# Altium schematic sheet Encoder_Input.SchDoc: STM32F446 CNC
size B; Author: AM; CompanyName: Expatria Technologies; DrawnBy: A.Marles; Engineer: AM; Organization: Expatria Technolgoies; DocumentNumber: 11; Revision: A1; SheetNumber: 11; SheetTotal: 14
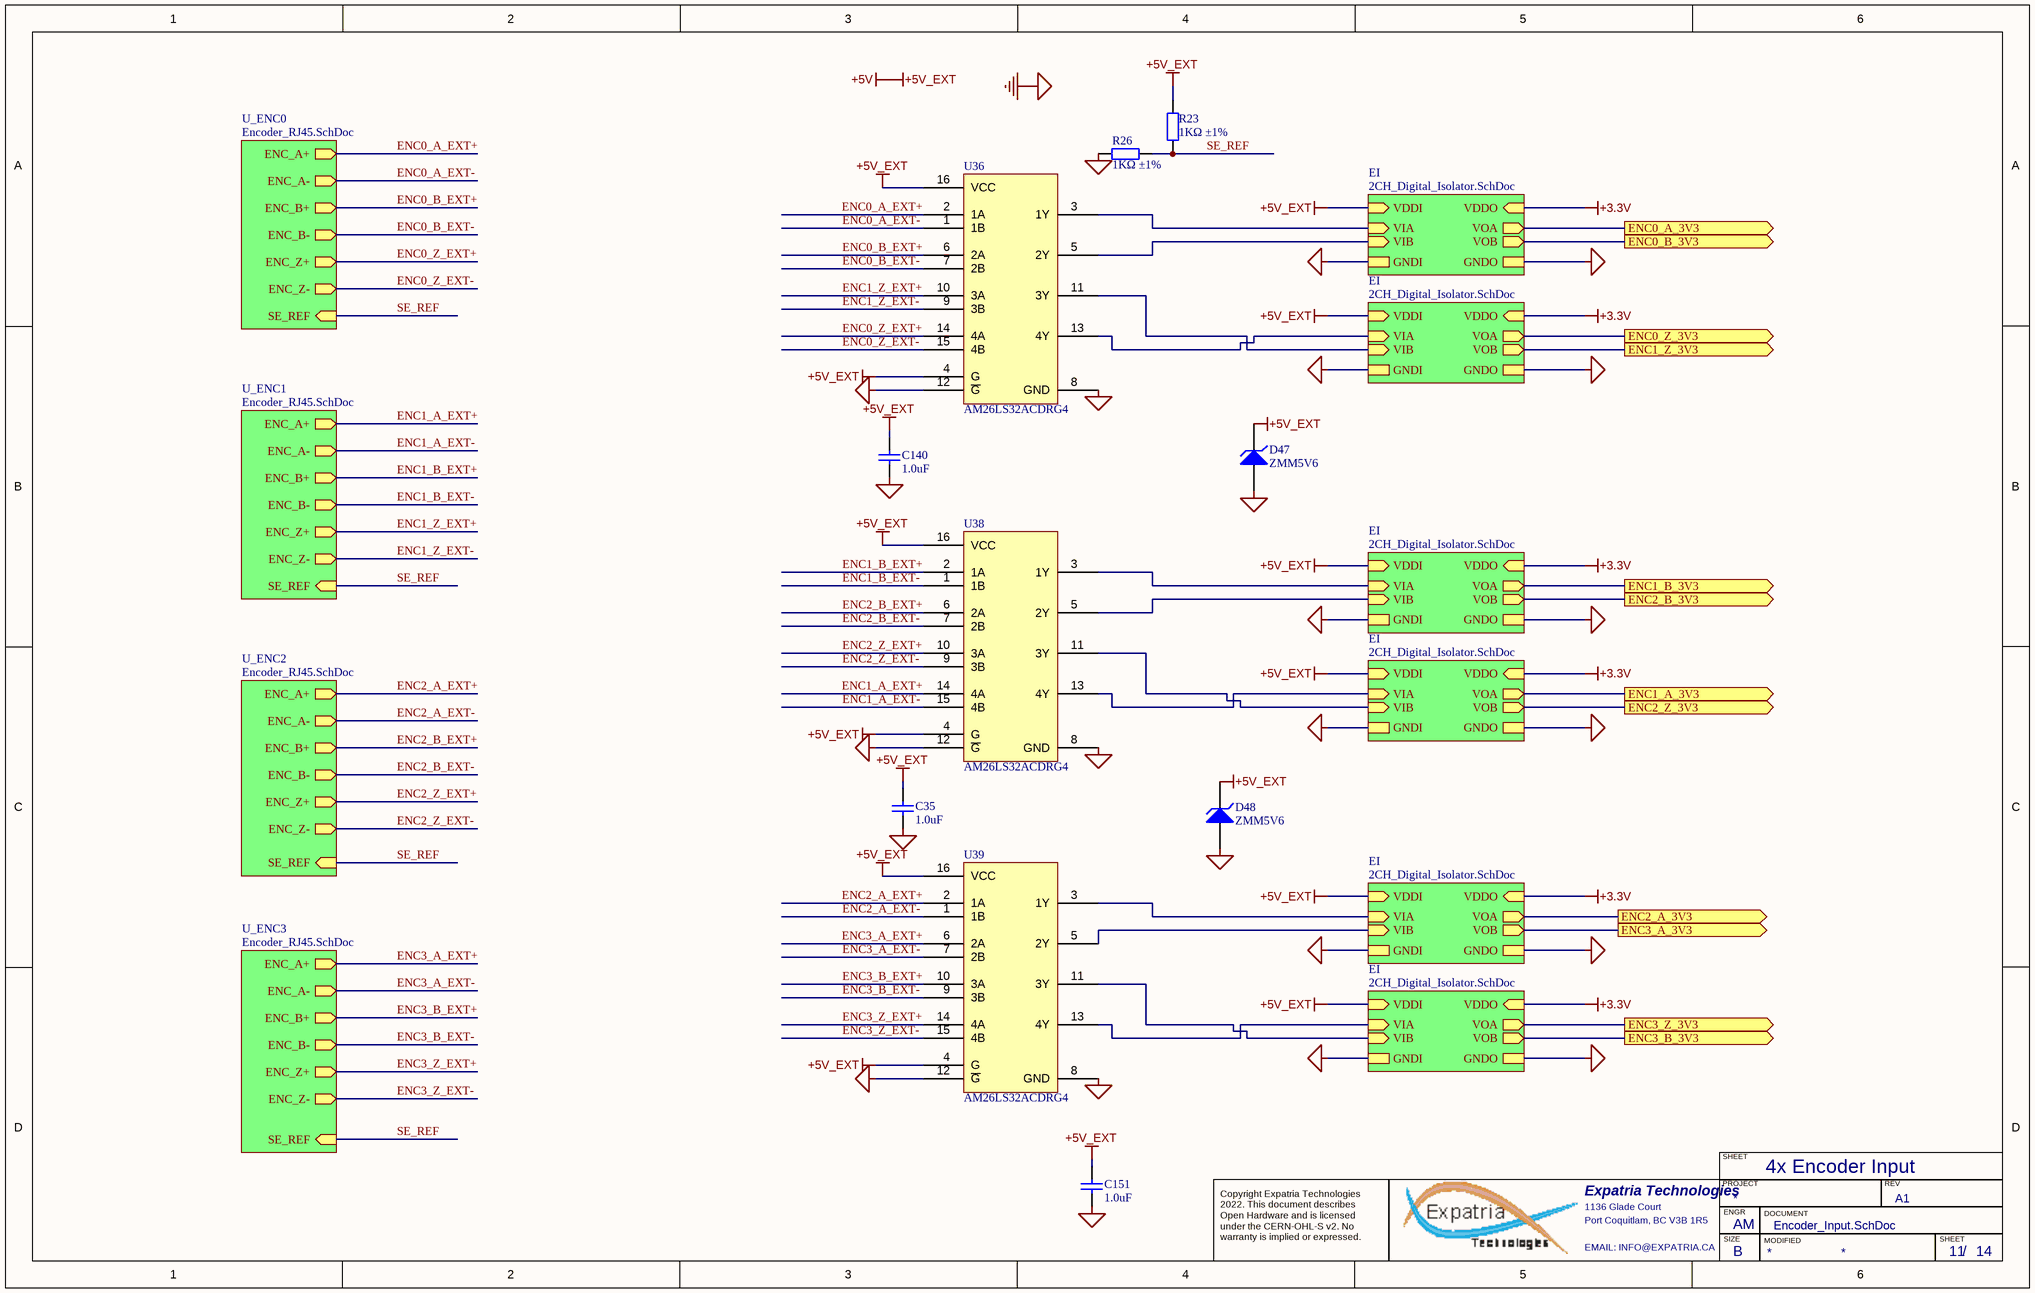
[diagram p0: Encoder_Input.SchDoc]

## Parts
C35  1.0uF  [0402_C]
C140  1.0uF  [0402_C]
C151  1.0uF  [0402_C]
D47  ZMM5V6  [LL-34]
D48  ZMM5V6  [LL-34]
R23  1KΩ ±1%  [0402_R]
R26  1KΩ ±1%  [0402_R]
U36  AM26LS32ACDRG4  [SOIC-16_150mil]
U38  AM26LS32ACDRG4  [SOIC-16_150mil]
U39  AM26LS32ACDRG4  [SOIC-16_150mil]

## Sub-sheets
EI = 2CH_Digital_Isolator.SchDoc: VDDO (in), VIB (in), VIA (in), VOB (out), VOA (out), VDDI (in), GNDO, GNDI
EI = 2CH_Digital_Isolator.SchDoc: VDDO (in), VIB (in), VIA (in), VOB (out), VOA (out), VDDI (in), GNDO, GNDI
EI = 2CH_Digital_Isolator.SchDoc: VDDO (in), VIB (in), VIA (in), VOB (out), VOA (out), VDDI (in), GNDO, GNDI
EI = 2CH_Digital_Isolator.SchDoc: VDDO (in), VIB (in), VIA (in), VOB (out), VOA (out), VDDI (in), GNDO, GNDI
EI = 2CH_Digital_Isolator.SchDoc: VDDO (in), VIB (in), VIA (in), VOB (out), VOA (out), VDDI (in), GNDO, GNDI
EI = 2CH_Digital_Isolator.SchDoc: VDDO (in), VIB (in), VIA (in), VOB (out), VOA (out), VDDI (in), GNDO, GNDI
U_ENC0 = Encoder_RJ45.SchDoc: ENC_A+ (out), ENC_A- (out), ENC_Z+ (out), ENC_Z- (out), ENC_B- (out), ENC_B+ (out), SE_REF (in)
U_ENC1 = Encoder_RJ45.SchDoc: ENC_A+ (out), ENC_A- (out), ENC_Z+ (out), ENC_Z- (out), ENC_B- (out), ENC_B+ (out), SE_REF (in)
U_ENC2 = Encoder_RJ45.SchDoc: ENC_A+ (out), ENC_A- (out), ENC_Z+ (out), ENC_Z- (out), ENC_B- (out), ENC_B+ (out), SE_REF (in)
U_ENC3 = Encoder_RJ45.SchDoc: ENC_A+ (out), ENC_A- (out), ENC_Z+ (out), ENC_Z- (out), ENC_B- (out), ENC_B+ (out), SE_REF (in)

## Ports
ENC0_A_3V3 (out), ENC0_B_3V3 (out), ENC0_Z_3V3 (out), ENC1_A_3V3 (out), ENC1_B_3V3 (out), ENC1_Z_3V3 (out), ENC2_A_3V3 (out), ENC2_B_3V3 (out), ENC2_Z_3V3 (out), ENC3_A_3V3 (out), ENC3_B_3V3 (out), ENC3_Z_3V3 (out)

## Nets
+3.3V: sheet EI/VDDO, sheet EI/VDDO, sheet EI/VDDO, sheet EI/VDDO, sheet EI/VDDO, sheet EI/VDDO
+5V: C35.2 C140.2 C151.2 D47.2(K) D48.2(K) R23.1 U36.4(G) U36.16(VCC) U38.4(G) U38.16(VCC) U39.4(G) U39.16(VCC) ; sheet EI/VDDI, sheet EI/VDDI, sheet EI/VDDI, sheet EI/VDDI, sheet EI/VDDI, sheet EI/VDDI  [also labelled +5V_EXT]
GND: C35.1 C140.1 C151.1 D47.1(A) D48.1(A) R26.1 U36.8(GND) U36.12(~{G}) U38.8(GND) U38.12(~{G}) U39.8(GND) U39.12(~{G}) ; sheet EI/GNDI, sheet EI/GNDI, sheet EI/GNDI, sheet EI/GNDI, sheet EI/GNDI, sheet EI/GNDI  [also labelled GND_EXT]
MCU_GND: sheet EI/GNDO, sheet EI/GNDO, sheet EI/GNDO, sheet EI/GNDO, sheet EI/GNDO, sheet EI/GNDO
ENC0_A_3V3: port ENC0_A_3V3, sheet EI/VOA
ENC0_A_EXT+: U36.2(1A) ; sheet U_ENC0/ENC_A+
ENC0_A_EXT-: U36.1(1B) ; sheet U_ENC0/ENC_A-
ENC0_B_3V3: port ENC0_B_3V3, sheet EI/VOB
ENC0_B_EXT+: U36.6(2A) ; sheet U_ENC0/ENC_B+
ENC0_B_EXT-: U36.7(2B) ; sheet U_ENC0/ENC_B-
ENC0_Z_3V3: port ENC0_Z_3V3, sheet EI/VOA
ENC0_Z_EXT+: U36.14(4A) ; sheet U_ENC0/ENC_Z+
ENC0_Z_EXT-: U36.15(4B) ; sheet U_ENC0/ENC_Z-
ENC1_A_3V3: port ENC1_A_3V3, sheet EI/VOA
ENC1_A_EXT+: U38.14(4A) ; sheet U_ENC1/ENC_A+
ENC1_A_EXT-: U38.15(4B) ; sheet U_ENC1/ENC_A-
ENC1_B_3V3: port ENC1_B_3V3, sheet EI/VOA
ENC1_B_EXT+: U38.2(1A) ; sheet U_ENC1/ENC_B+
ENC1_B_EXT-: U38.1(1B) ; sheet U_ENC1/ENC_B-
ENC1_Z_3V3: port ENC1_Z_3V3, sheet EI/VOB
ENC1_Z_EXT+: U36.10(3A) ; sheet U_ENC1/ENC_Z+
ENC1_Z_EXT-: U36.9(3B) ; sheet U_ENC1/ENC_Z-
ENC2_A_3V3: port ENC2_A_3V3, sheet EI/VOA
ENC2_A_EXT+: U39.2(1A) ; sheet U_ENC2/ENC_A+
ENC2_A_EXT-: U39.1(1B) ; sheet U_ENC2/ENC_A-
ENC2_B_3V3: port ENC2_B_3V3, sheet EI/VOB
ENC2_B_EXT+: U38.6(2A) ; sheet U_ENC2/ENC_B+
ENC2_B_EXT-: U38.7(2B) ; sheet U_ENC2/ENC_B-
ENC2_Z_3V3: port ENC2_Z_3V3, sheet EI/VOB
ENC2_Z_EXT+: U38.10(3A) ; sheet U_ENC2/ENC_Z+
ENC2_Z_EXT-: U38.9(3B) ; sheet U_ENC2/ENC_Z-
ENC3_A_3V3: port ENC3_A_3V3, sheet EI/VOB
ENC3_A_EXT+: U39.6(2A) ; sheet U_ENC3/ENC_A+
ENC3_A_EXT-: U39.7(2B) ; sheet U_ENC3/ENC_A-
ENC3_B_3V3: port ENC3_B_3V3, sheet EI/VOB
ENC3_B_EXT+: U39.10(3A) ; sheet U_ENC3/ENC_B+
ENC3_B_EXT-: U39.9(3B) ; sheet U_ENC3/ENC_B-
ENC3_Z_3V3: port ENC3_Z_3V3, sheet EI/VOA
ENC3_Z_EXT+: U39.14(4A) ; sheet U_ENC3/ENC_Z+
ENC3_Z_EXT-: U39.15(4B) ; sheet U_ENC3/ENC_Z-
SE_REF: R23.2 R26.2 ; sheet U_ENC0/SE_REF, sheet U_ENC1/SE_REF, sheet U_ENC2/SE_REF, sheet U_ENC3/SE_REF
NetU36_3: U36.3(1Y) ; sheet EI/VIA
NetU36_5: U36.5(2Y) ; sheet EI/VIB
NetU36_11: U36.11(3Y) ; sheet EI/VIB
NetU36_13: U36.13(4Y) ; sheet EI/VIA
NetU38_3: U38.3(1Y) ; sheet EI/VIA
NetU38_5: U38.5(2Y) ; sheet EI/VIB
NetU38_11: U38.11(3Y) ; sheet EI/VIB
NetU38_13: U38.13(4Y) ; sheet EI/VIA
NetU39_3: U39.3(1Y) ; sheet EI/VIA
NetU39_5: U39.5(2Y) ; sheet EI/VIB
NetU39_11: U39.11(3Y) ; sheet EI/VIB
NetU39_13: U39.13(4Y) ; sheet EI/VIA

## Notes on the sheet
- 4x Encoder Input
- SHEET
- Expatria Technologies
- 1136 Glade Court
- Port Coquitlam, BC V3B 1R5
- PROJECT
- SIZE
- ENGR
- MODIFIED
- DOCUMENT
- REV
- Copyright Expatria Technologies 2022. This document describes Open Hardware and is licensed under the CERN-OHL-S v2. No warranty is implied or expressed.
- EMAIL: INFO@EXPATRIA.CA
- B
- /

## Library data of the parts
C35 C140 C151 = 0402 1.0uF (105) 10% 25V: Chip capacitor; Manufacturer: Samsung Electro-Mechanics; PartNumber: CL05A105KA5NQNC; Capacitance: 1uF; Tolerance: 10%; Voltage: 25V; ComponentLink1Description: Supplier link; ComponentLink1URL: http://www.szlcsc.com/product/details_53938.html; Package: 0402; Supplier: LC; SuppliersPartNumber: C52923
D47 D48 = LL-34 ZMM5V6: 500mW - 0.1uA @ 1V 5.6V LL-34 Zener Diodes ROHS; ComponentLink1Description: 供应商链接; ComponentLink1URL: http://www.szlcsc.com/product/details_8541.html; Package: LL-34; Supplier: LC; SuppliersPartNumber: C8062
R23 R26 = 0402 1K (1001) 1%: Chip resistor; Manufacturer: Uniroyal Elec; PartNumber: 0402WGF1001TCE; Power: 1/16W; ComponentLink1Description: Supplier link; ComponentLink1URL: http://www.szlcsc.com/product/details_12256.html; Package: 0402; Supplier: LC; SuppliersPartNumber: C11702; Resistance: 1KΩ; Tolerance: 1%
U36 U38 U39 = AM26LS32ACDRG4_[C6180]: RS-422 Interface IC Quad Diff Line Rcvr; ComponentLink1Description: 供应商链接; ComponentLink1URL: http://www.szlcsc.com/product/details_6646.html; Package: SOIC-16_150mil; Supplier: LC; SuppliersPartNumber: C6180